# EAGLE design tilt_soms_lgbu_v2 (EAGLE 9.1.1)
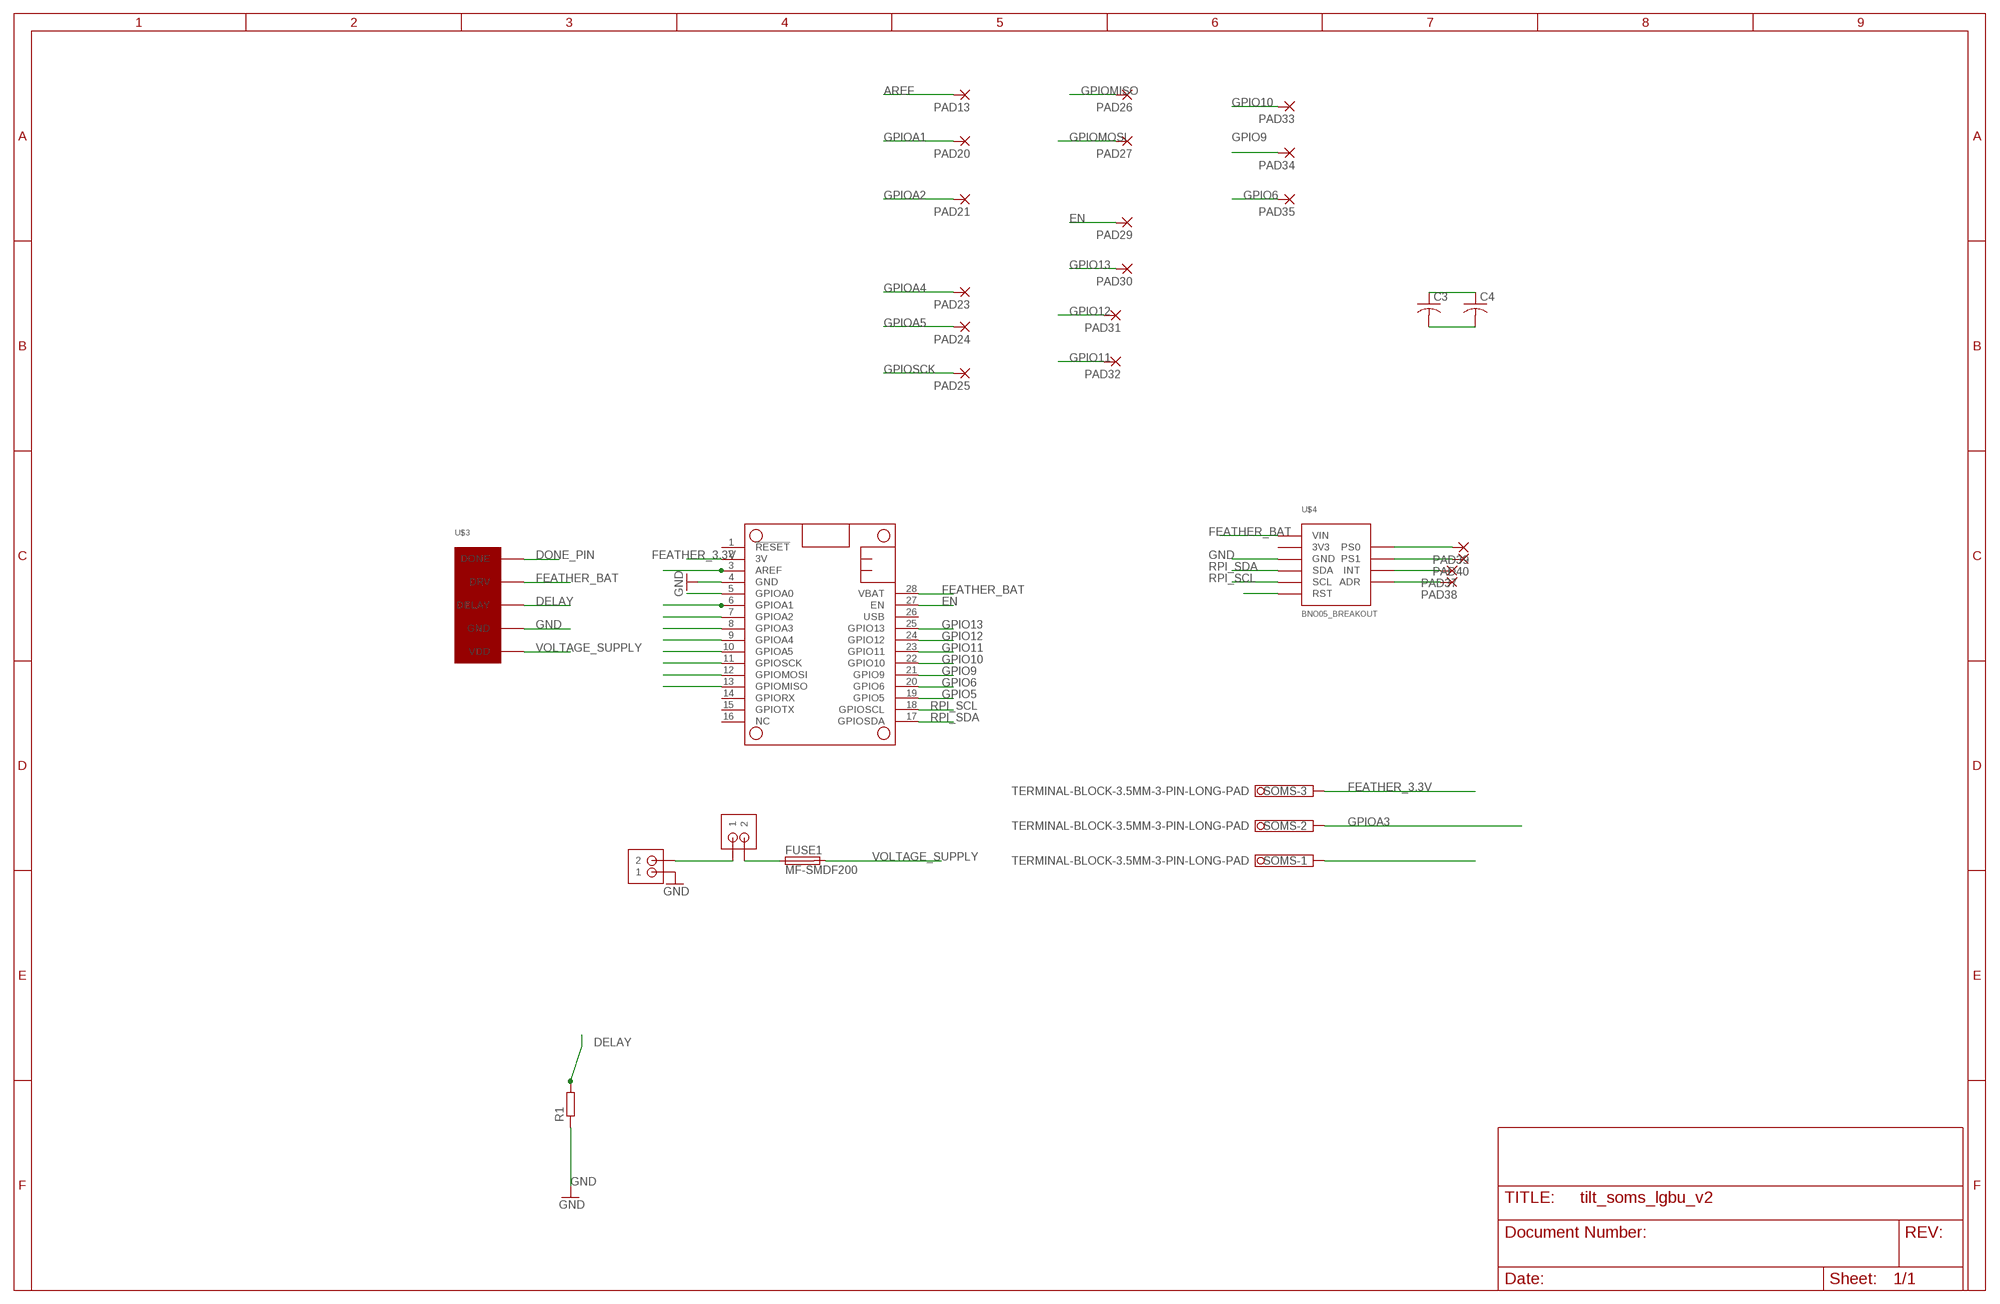
[diagram p0: schematic, sheet 1]

## Parts
BATT  JST-PH_2-PIN_HEADER  [JST_B2B-PH_HEADER]
C3  C-USC1812  [C1812]
C4  C-USC1812  [C1812]
FUSE1  MF-SMDF200  [MF-SMDF050]
MAIN_SWITCH  JST-PH_2-PIN_HEADER  [JST_B2B-PH_HEADER]
MS1  FEATHERWING_NODIM  [FEATHERWING_DIM]
PAD13  WIREPADSMD1,27-254  [SMD1,27-2,54]
PAD20  WIREPADSMD1,27-254  [SMD1,27-2,54]
PAD21  WIREPADSMD1,27-254  [SMD1,27-2,54]
PAD23  WIREPADSMD1,27-254  [SMD1,27-2,54]
PAD24  WIREPADSMD1,27-254  [SMD1,27-2,54]
PAD25  WIREPADSMD1,27-254  [SMD1,27-2,54]
PAD26  WIREPADSMD1,27-254  [SMD1,27-2,54]
PAD27  WIREPADSMD1,27-254  [SMD1,27-2,54]
PAD29  WIREPADSMD1,27-254  [SMD1,27-2,54]
PAD30  WIREPADSMD1,27-254  [SMD1,27-2,54]
PAD31  WIREPADSMD1,27-254  [SMD1,27-2,54]
PAD32  WIREPADSMD1,27-254  [SMD1,27-2,54]
PAD33  WIREPADSMD1,27-254  [SMD1,27-2,54]
PAD34  WIREPADSMD1,27-254  [SMD1,27-2,54]
PAD35  WIREPADSMD1,27-254  [SMD1,27-2,54]
PAD37  WIREPADSMD1,27-254  [SMD1,27-2,54]
PAD38  WIREPADSMD1,27-254  [SMD1,27-2,54]
PAD39  WIREPADSMD1,27-254  [SMD1,27-2,54]
PAD40  WIREPADSMD1,27-254  [SMD1,27-2,54]
R1  R-EU_0309/12  [0309/12]
SOMS  TERMINAL-BLOCK-3.5MM-3-PIN-LONG-PAD  [TERMINAL-BLOCK-3-PIN-3.5MM-LONG-PAD]
U$3  TPL5110_BREAKOUT  [TPL5110_BREAKOUT]
U$4  BNO05_BREAKOUT  [BNO05_BREAKOUT]

## Nets
AREF: MS1.3(AREF) PAD13.1(P)
DELAY: R1.2 U$3.DELAY
DONE_PIN: MS1.5(GPIOA0) U$3.DONE
EN: MS1.27(EN) PAD29.1(P)
FEATHER_3.3V: MS1.2(3V) SOMS.3
FEATHER_BAT: MS1.28(VBAT) U$3.DRV U$4.VIN
GND: BATT.P1 C3.2 C4.2 MS1.4(GND) R1.1 SOMS.1 U$3.GND U$4.GND
GPIO5: MS1.19(GPIO5) U$4.RST
GPIO6: MS1.20(GPIO6) PAD35.1(P)
GPIO9: MS1.21(GPIO9) PAD34.1(P)
GPIO10: MS1.22(GPIO10) PAD33.1(P)
GPIO11: MS1.23(GPIO11) PAD32.1(P)
GPIO12: MS1.24(GPIO12) PAD31.1(P)
GPIO13: MS1.25(GPIO13) PAD30.1(P)
GPIOA1: MS1.6(GPIOA1) PAD20.1(P)
GPIOA2: MS1.7(GPIOA2) PAD21.1(P)
GPIOA3: MS1.8(GPIOA3) SOMS.2
GPIOA4: MS1.9(GPIOA4) PAD23.1(P)
GPIOA5: MS1.10(GPIOA5) PAD24.1(P)
GPIOMISO: MS1.13(GPIOMISO) PAD26.1(P)
GPIOMOSI: MS1.12(GPIOMOSI) PAD27.1(P)
GPIOSCK: MS1.11(GPIOSCK) PAD25.1(P)
N$1: PAD37.1(P) U$4.INT
N$3: BATT.P2 MAIN_SWITCH.P1
N$4: FUSE1.1 MAIN_SWITCH.P2
N$5: PAD38.1(P) U$4.ADR
N$6: PAD39.1(P) U$4.PS0
N$7: PAD40.1(P) U$4.PS1
RPI_SCL: MS1.18(GPIOSCL) U$4.SCL
RPI_SDA: MS1.17(GPIOSDA) U$4.SDA
VOLTAGE_SUPPLY: C3.1 C4.1 FUSE1.2 U$3.VDD
Unconnected: MS1.1(!RESET) MS1.14(GPIORX) MS1.15(GPIOTX) MS1.16(NC) MS1.26(USB) U$4.3V3

## Library data of the parts
BATT MAIN_SWITCH = SRG:JST-PH_2-PIN_HEADER: 2-pin JST PH Shrouded Header, top entry P/N B2B-PH-K-S Mating connector PHR-2 Mating cable assembly: Sparkfun PRT-09914 <http://www.sparkfun.com/products/9914>
C3 C4 = rcl:C-US: CAPACITOR, American symbol
FUSE1 = fuse:MF-SMDF: MF-SMDF Series - PRC Resettable Fuses Source: http://www.farnell.com/datasheets/716597.pdf
MS1 = adafruit:FEATHERWING
PAD13 PAD20 PAD21 PAD23-PAD27 PAD29-PAD35 PAD37-PAD40 = wirepad:WIREPAD: Wire PAD connect wire on PCB
R1 = rcl:R-EU_: RESISTOR, European symbol
SOMS = Rembrandt Electronics - Terminal Block 3-5mm v1-0:TERMINAL-BLOCK-3.5MM-3-PIN: Terminal Block 3.5mm Pitch: 3,5 mm Number of pins: 3 Created by Rembrandt Electronics www.rembrandtelectronics.com
U$3 = edc_modules:TPL5110_BREAKOUT
U$4 = edc_modules:BNO05_BREAKOUT

## Board
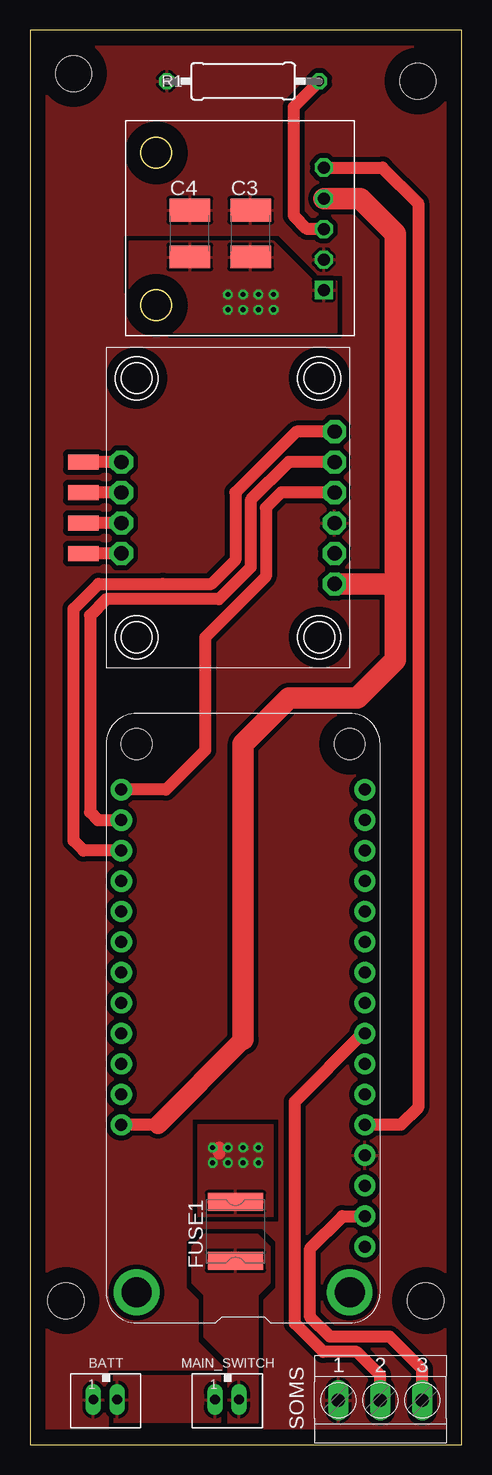
[diagram p1: board, top side]
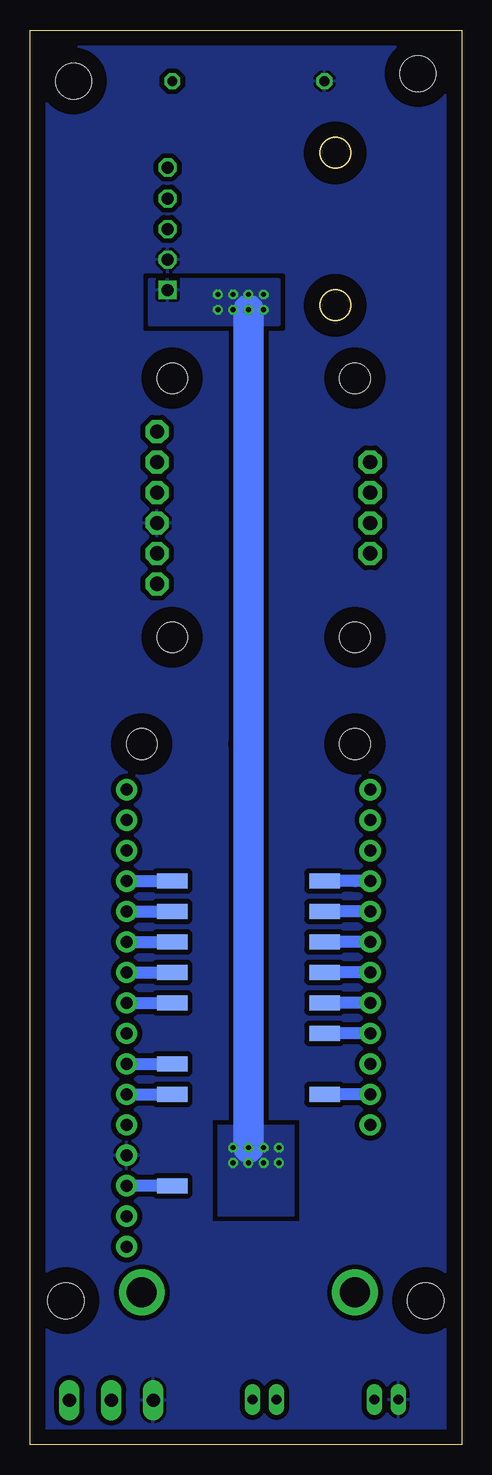
[diagram p2: board, bottom side, seen from below]

Size 36 x 117.94 mm. Coordinates in mm from the lower left corner, seen from the top.
Outline: 36,117.94 0,117.94 0,0 36,0 36,117.94
Copper layers (1*16): Top 0.035mm / dielectric 1.5mm / Bottom 0.035mm
Design rules "default *": minimum track width 8mil, minimum drill 0.35mm, track to track 10mil, track to pad 10mil, pad to pad 10mil, via to via 10mil, smd to smd 6mil, copper to edge 50mil, drill to drill 10mil, minimum pad ring 10mil, minimum via ring 8mil, stop-mask expansion 4mil, vias tented up to drill 0mil, thermal gap 10mil
Holes 3 mm at 33,12 3,12 32.37,113.67 3.63,114.3

### Footprints (pad centres in the part's own frame; a part is rotated, then mirrored left to right if it is on the bottom)
JST_B2B-PH_HEADER = drill 0.8 long: P1 1.075,0.048; P2 -0.925,0.048
C1812 = smd 1.9 x 3.4: 1 -1.95,0; 2 1.95,0
MF-SMDF050 = smd 1.5 x 4.6: 1 -2.45,0; 2 2.45,0
FEATHERWING_DIM = drill 1 pad 1.778: 1 6.35,1.27; 2 8.89,1.27; 3 11.43,1.27; 4 13.97,1.27; 5 16.51,1.27; 6 19.05,1.27; 7 21.59,1.27; 8 24.13,1.27; 9 26.67,1.27; 10 29.21,1.27; 11 31.75,1.27; 12 34.29,1.27; 13 36.83,1.27; 14 39.37,1.27; 15 41.91,1.27; 16 44.45,1.27; 17 44.45,21.59; 18 41.91,21.59; 19 39.37,21.59; 20 36.83,21.59; 21 34.29,21.59; 22 31.75,21.59; 23 29.21,21.59; 24 26.67,21.59; 25 24.13,21.59; 26 21.59,21.59; 27 19.05,21.59; 28 16.51,21.59 | drill 2.5 pad 3.81: P$1 2.54,20.32; P$2 2.54,2.54 | hole 2.54: 48.26,20.32; 48.26,2.54
SMD1,27-2,54 = smd 1.27 x 2.54: 1 0,0
0309/12 = drill 0.813 octagon: 1 -6.35,0; 2 6.35,0
TERMINAL-BLOCK-3-PIN-3.5MM-LONG-PAD = drill 1.1 pad 1.7 long: 1 -3.5,-0.1; 2 0,-0.1; 3 3.5,-0.1
TPL5110_BREAKOUT = drill 1 octagon: DELAY 7.366,2.159; DONE 12.496,2.159; DRV 9.906,2.159; GND 4.826,2.159 | drill 1 square: VDD 2.286,2.159
BNO05_BREAKOUT = drill 1.2 pad 1.93 octagon: 3V3 9.525,1.27; ADR 17.145,19.05; GND 12.065,1.27; INT 14.605,19.05; PS0 9.525,19.05; PS1 12.065,19.05; RST 19.685,1.27; SCL 17.145,1.27; SDA 14.605,1.27; VIN 6.985,1.27 | hole 2.54: 2.54,17.78; 2.54,2.54; 24.13,2.54; 24.13,17.78

### Placement (x,y rotation side)
BATT  6.35,3.81 180 top
C3  18.41,100.97 90 top
C4  13.34,100.97 90 top
FUSE1  17.14,17.78 90 top
MAIN_SWITCH  16.51,3.81 180 top
MS1  29.21,10.16 90 top
PAD13  24.13,21.59 270 bottom
PAD20  24.13,29.21 90 bottom
PAD21  24.13,31.75 90 bottom
PAD23  24.13,36.83 90 bottom
PAD24  24.13,39.37 90 bottom
PAD25  24.13,41.91 90 bottom
PAD26  24.13,46.99 90 bottom
PAD27  24.13,44.45 90 bottom
PAD29  11.43,29.21 90 bottom
PAD30  11.43,34.29 90 bottom
PAD31  11.43,36.83 90 bottom
PAD32  11.43,39.37 90 bottom
PAD33  11.43,41.91 90 bottom
PAD34  11.43,44.45 90 bottom
PAD35  11.43,46.99 90 bottom
PAD37  4.45,79.38 270 top
PAD38  4.45,81.92 270 top
PAD39  4.45,74.3 270 top
PAD40  4.45,76.83 270 top
R1  17.78,113.67 0 top
SOMS  29.21,3.81 0 top
U$3  26.67,93.98 90 top
U$4  26.67,64.77 90 top

### Tracks (layer width: path | path; a pad name or v marks a point on that pad's centre or on a via)
AREF
  Bottom 1.016: PAD13.1 MS1.3
DELAY
  Top 1.016: U$3.DELAY 23.11,101.35 22,102.46 22,111.53 R1.2
DONE_PIN
  Top 1.016: MS1.5 30.95,26.67 32.38,28.1 32.38,103.5 29.41,106.48 U$3.DONE
EN
  Bottom 1.016: MS1.27 PAD29.1
FEATHER_3.3V
  Top 1.016: SOMS.3 32.71,6.29 30,9 25,9 23.36,10.63 23.36,16.36 26.05,19.05 MS1.2
FEATHER_BAT
  Top 1.016: 10.67,26.67 MS1.28
  Top 1.524: 17.78,33.78 10.67,26.67
  Top 1.778: 17.78,33.78 17.78,58.42 21.59,62.23 27.3,62.23 30.48,65.41 30.48,71.75 | U$3.DRV 27.56,103.89 30.48,100.97 30.48,71.75 | U$4.VIN 30.48,71.75
GND
  pour Bottom (isolate 0.406, rank 6): 36,116.67 0,116.67 0,0 36,0
  pour Top (isolate 0.406, rank 6): 36,117.3 0,117.3 0,0 36,0
GPIO5
  Top 1.016: U$4.RST 22.23,84.45 17.14,79.38 17.14,73.77 15.13,71.75 11.1,71.75 5.71,71.75 3.63,69.67 3.63,50.37 4.47,49.53 MS1.19
GPIO6
  Bottom 1.016: MS1.20 8.89,46.99 PAD35.1
GPIO9
  Bottom 1.016: MS1.21 PAD34.1
GPIO10
  Bottom 1.016: MS1.22 PAD33.1
GPIO11
  Bottom 1.016: MS1.23 PAD32.1
GPIO12
  Bottom 1.016: MS1.24 PAD31.1
GPIO13
  Bottom 1.016: MS1.25 PAD30.1
GPIOA1
  Bottom 1.016: MS1.6 PAD20.1
GPIOA2
  Bottom 1.016: MS1.7 PAD21.1
GPIOA3
  Top 1.016: SOMS.2 29.21,5.79 27.27,7.73 24.47,7.73 22.09,10.11 22.09,28.59 27.79,34.29
  Top 1.27: 27.79,34.29 MS1.8
GPIOA4
  Bottom 1.016: MS1.9 PAD23.1
GPIOA5
  Bottom 1.016: MS1.10 PAD24.1
GPIOMISO
  Bottom 1.016: MS1.13 PAD26.1
GPIOMOSI
  Bottom 1.016: MS1.12 PAD27.1
GPIOSCK
  Bottom 1.016: MS1.11 PAD25.1
N$1
  Top 1.016: U$4.INT PAD37.1
N$3
  pour Top: 7,4 7,1.91 15.88,1.91 15.88,5.71 6.99,5.71 6.99,4.01
N$4
  Top 1.016: 17.07,15.4 FUSE1.1 17.34,15.13 | 17.51,3.76 MAIN_SWITCH.P2
  pour Top: 16.51,1.86 19,1.86 19,12.5 20,13.5 20,16.5 19,17.5 14.5,17.5 13.5,16.5 13.5,13.5 14.5,12.5 14.5,9 16.51,6.99
N$5
  Top 1.016: U$4.ADR PAD38.1
N$6
  Top 1.016: U$4.PS0 PAD39.1
N$7
  Top 1.016: U$4.PS1 PAD40.1
RPI_SCL
  Top 1.016: U$4.SCL 21.59,81.92 18.41,78.74 18.41,73.13 15.77,70.48 6.35,70.48 5,69.14 5,52.73 5.66,52.07 MS1.18
RPI_SDA
  Top 1.016: MS1.17 11.34,54.61 14.61,57.87 14.61,67.31 19.68,72.39 19.68,78.11 20.95,79.38 U$4.SDA
VOLTAGE_SUPPLY  (via drill 0.4)
  Top 1.016: 15.78,24.27 15.78,24.77
  Bottom 2.54: v17.78,94.61 17.78,58.42 v17.78,24.77
  other vias: 16.51,24.77 15.24,24.77 15.24,23.5 16.51,94.61 19.05,94.61 20.32,94.61 16.51,95.89 17.78,95.89 19.05,95.89 20.32,95.89 19.05,24.77 16.51,23.5 17.78,23.5 19.05,23.5
  pour Top (isolate 0.254): 25.59,92.71 12.7,92.71 8.26,92.71 8.26,100.33 20.32,100.33 23.65,97 25.59,97
  pour Top: 20.32,19.05 20.32,26.67 13.97,26.67 13.97,19.05
  pour Bottom: 20.32,19.05 20.32,26.67 13.97,26.67 13.97,19.05
  pour Bottom: 15.24,97.16 15.24,93.34 26.04,93.34 26.04,97.16